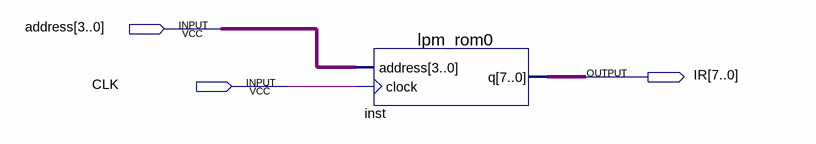
[diagram p0: schematic sheet]
// Quartus schematic ROM.bdf as structural Verilog: 1 symbols, 3 pins
module ROM (
  input  [3:0] address,
  input  CLK,
  output [7:0] IR
);

  lpm_rom0 inst (.address(address), .clock(CLK), .q(IR));
endmodule
